# Altium schematic sheet Принципиальная.SchDoc
size 840 x 594 mm; Address1: Address1; Address2: Address2; Address3: Address3; Address4: Address4; SheetNumber: 1; Scale: 1:1; Разраб.: Иванов; Обозначение документа: АБВГ.123456.001 Э3; Пров.: Петров; Утв.: Сидоров; Наименование организации: ОАО "Концерн "МПО-Гидроприбор"; Перв. применение: АБВГ.123456.000; Наименование изделия 1: Плата; Наименование изделия 2: Схема электрическая; Наименование изделия 3: принципиальная; Нач. отд.: Нач. отд.; Фамилия нач. отд.: Сидоров
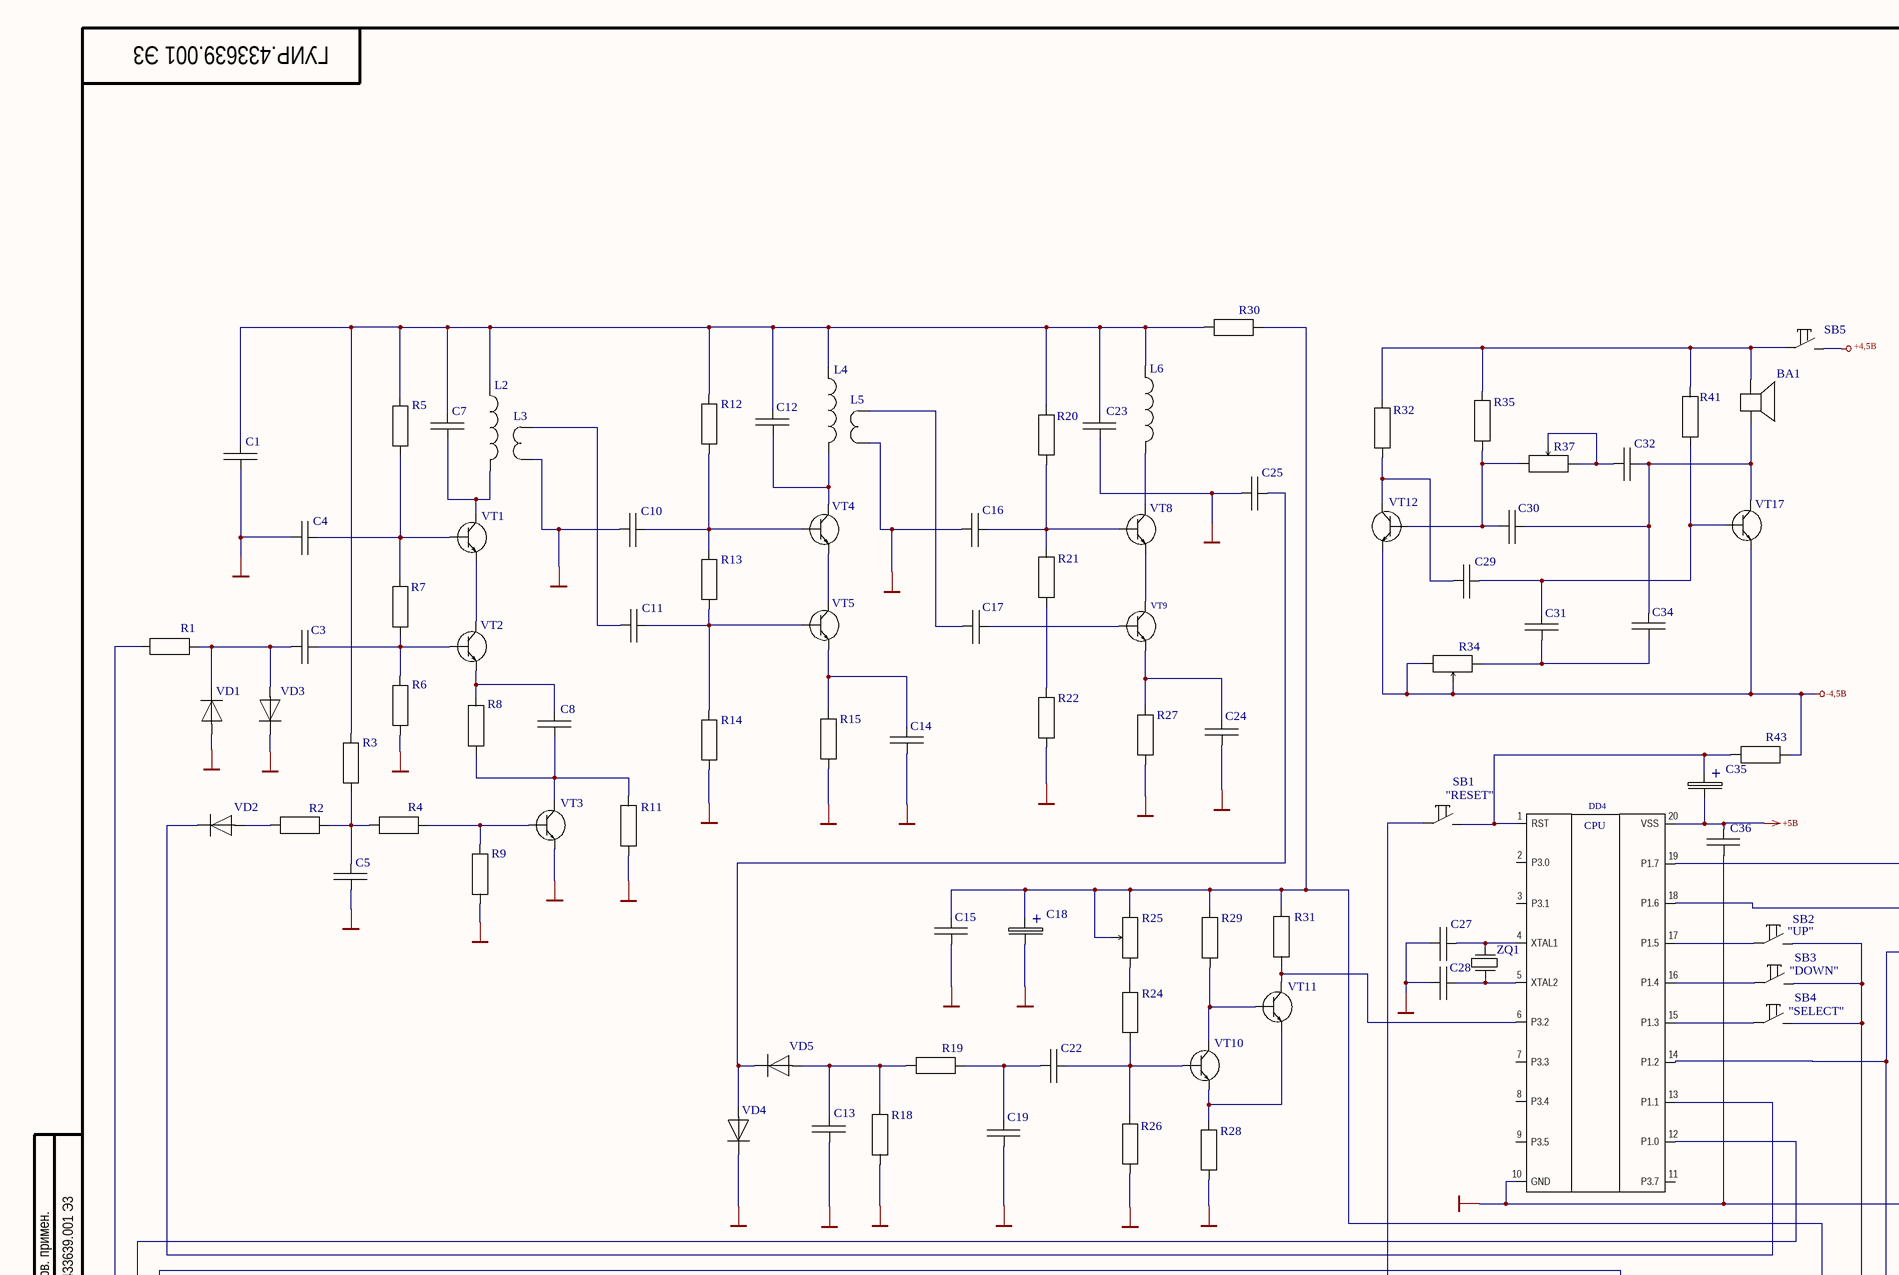
[diagram p0: Принципиальная.SchDoc, top left]
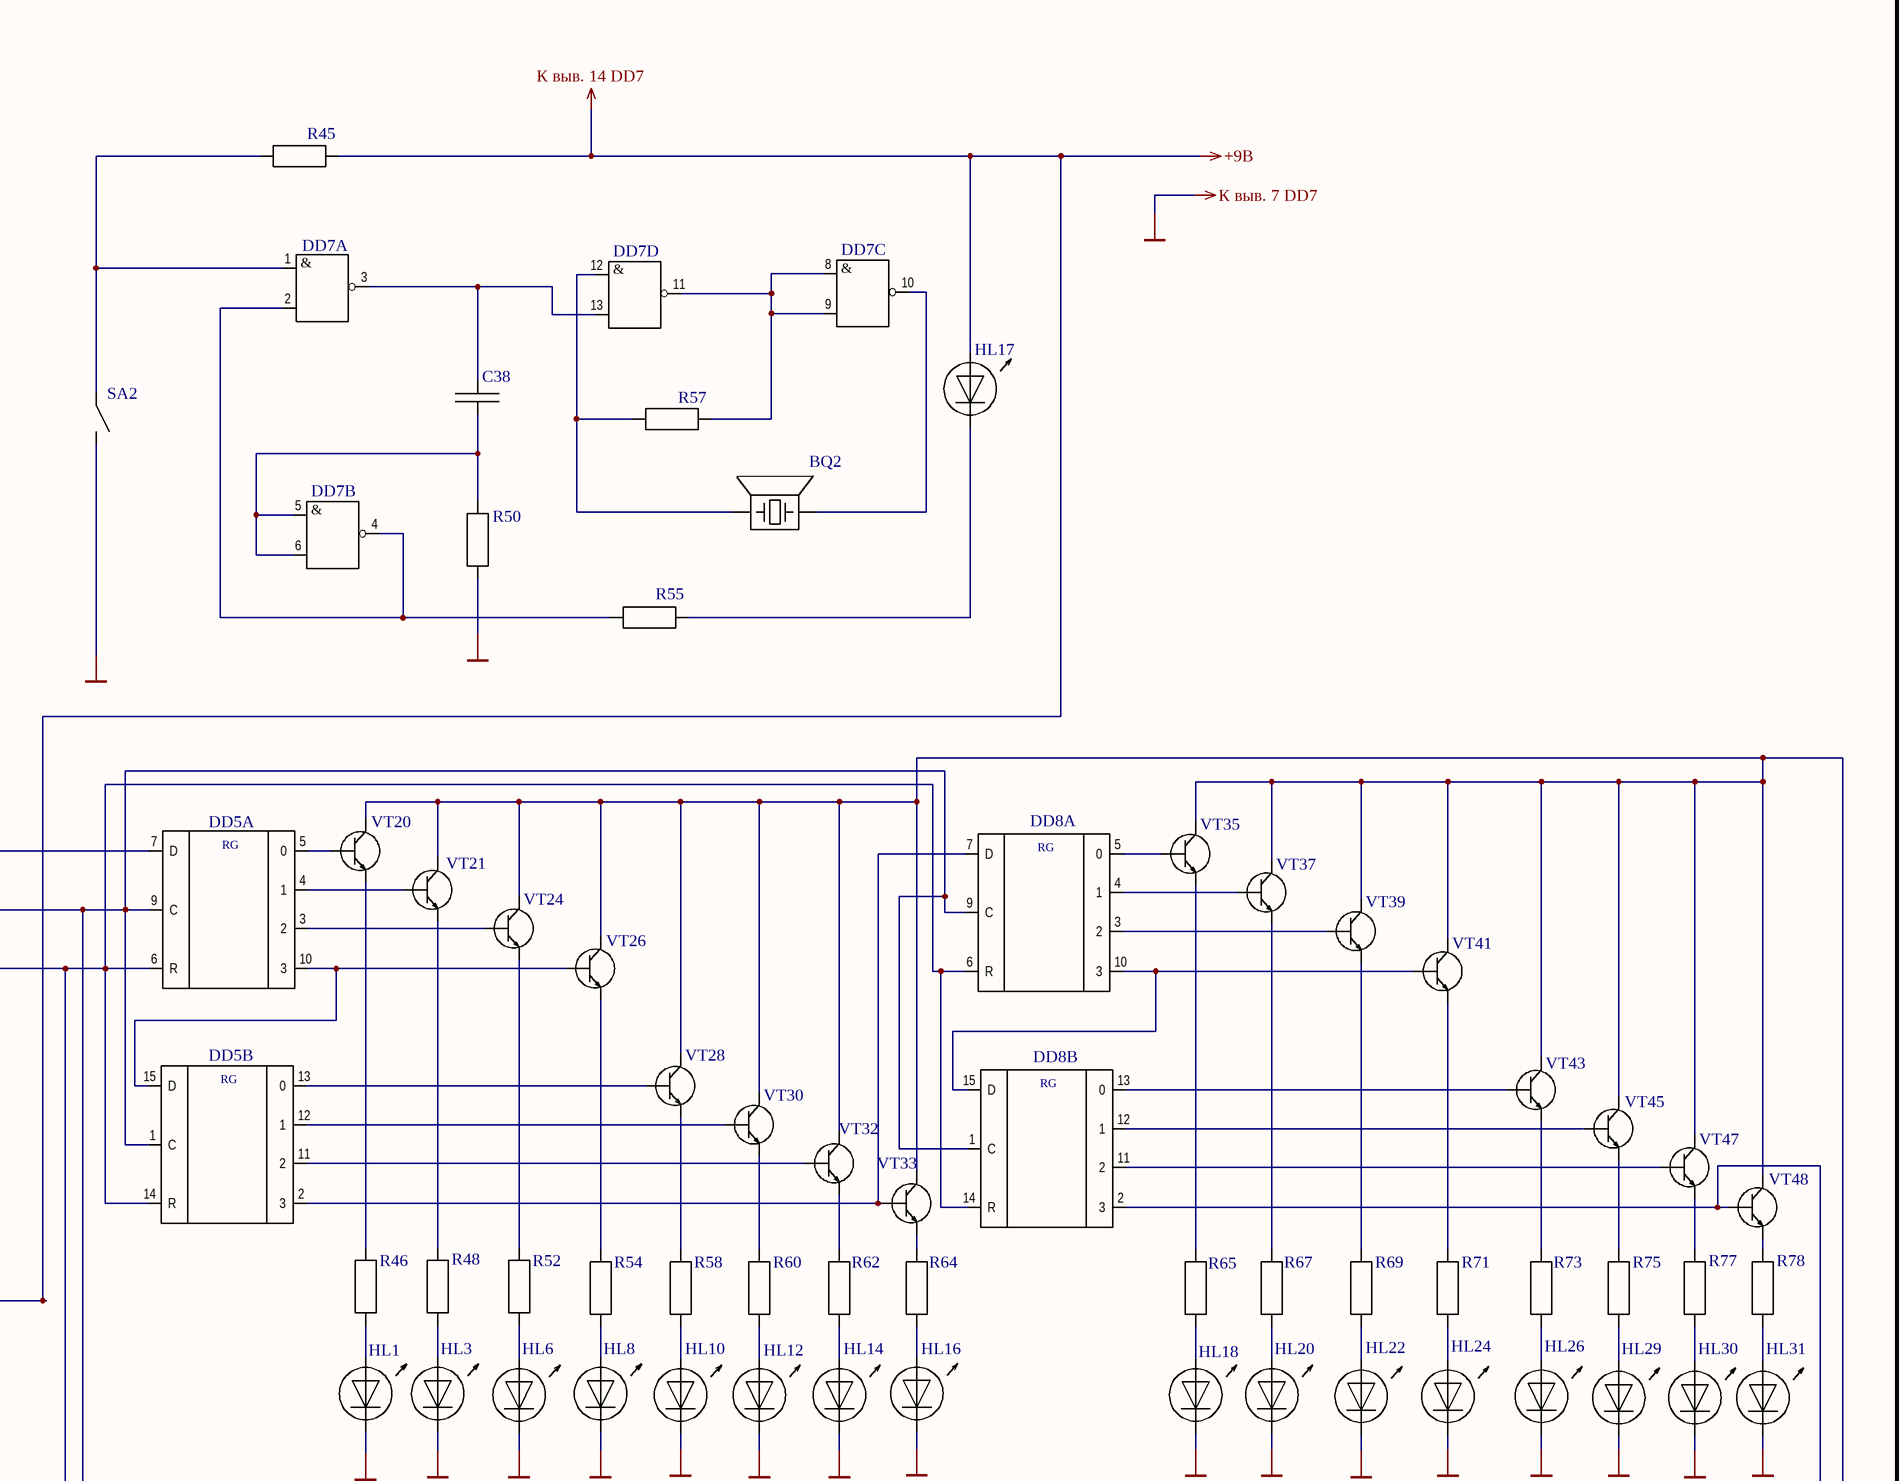
[diagram p1: Принципиальная.SchDoc, top right]
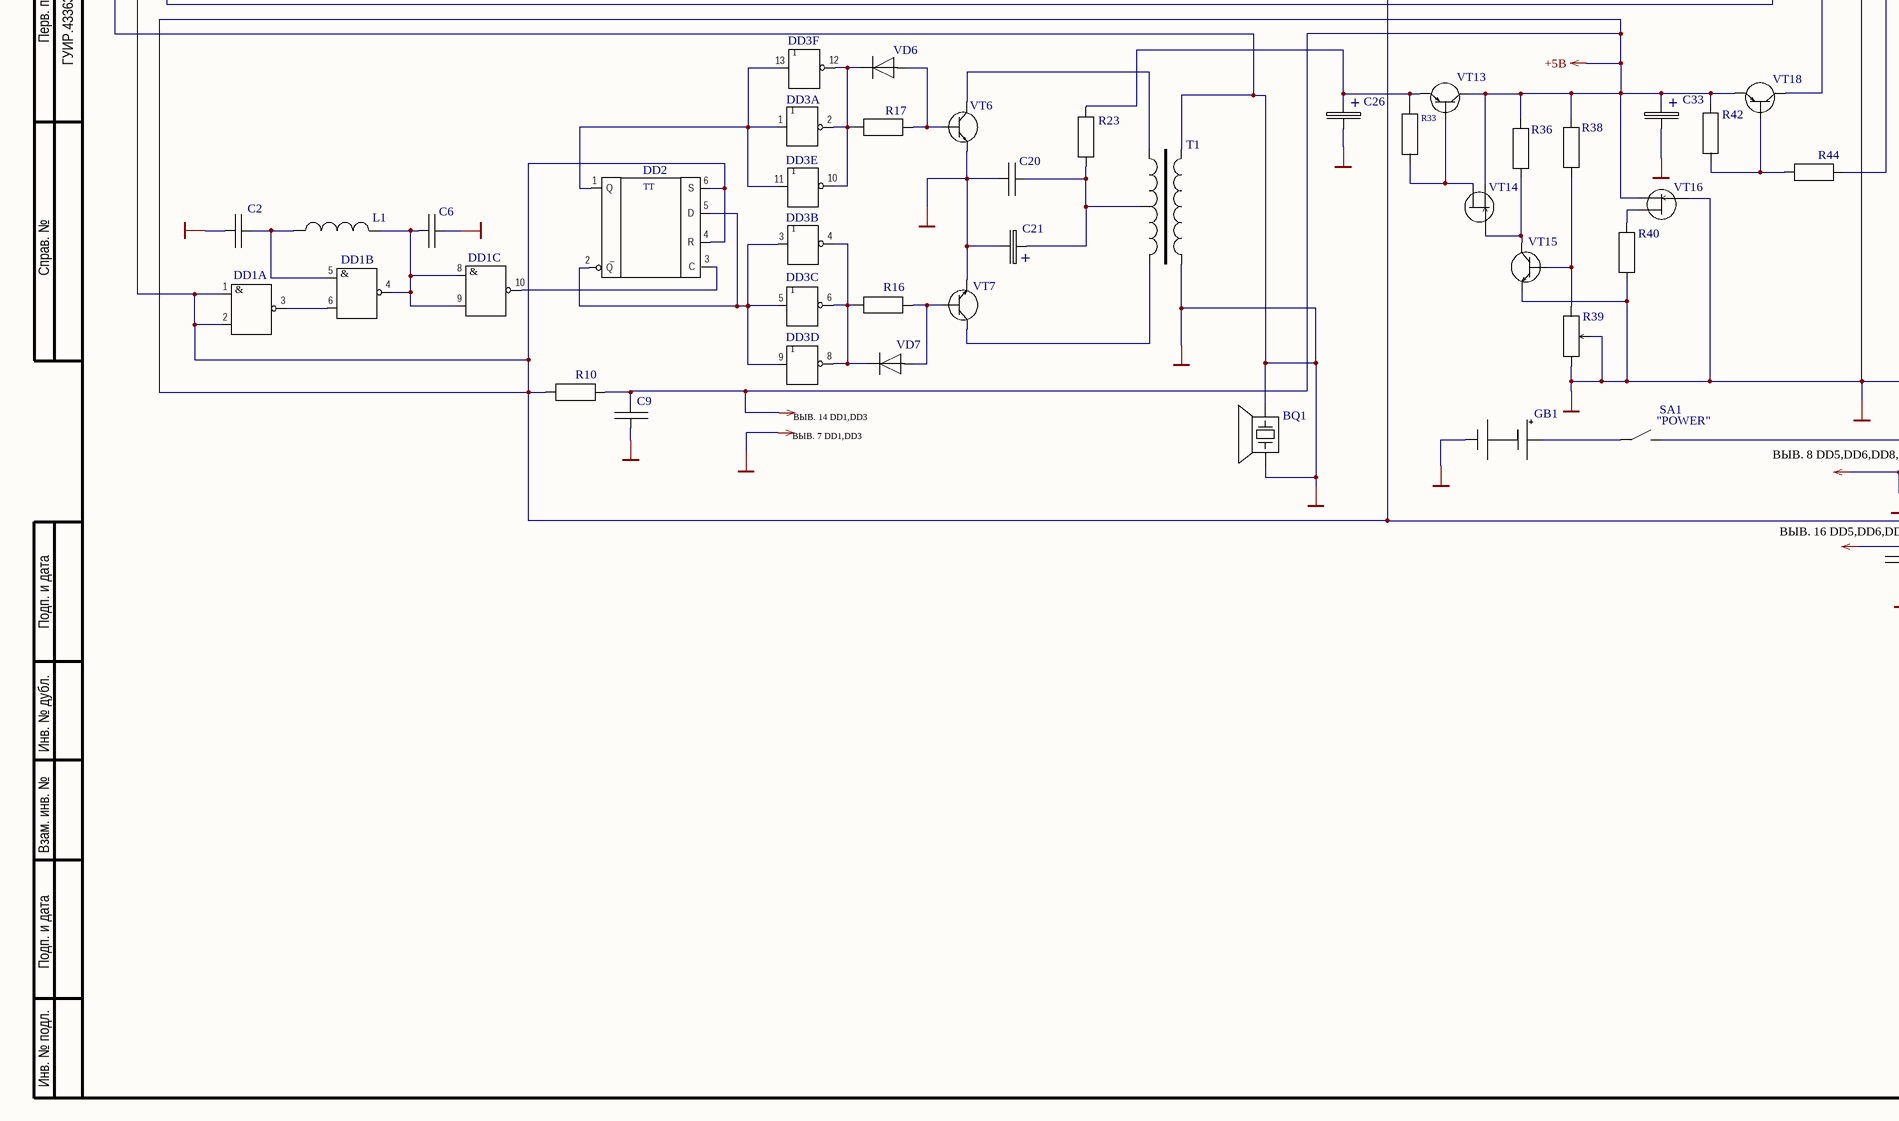
[diagram p2: Принципиальная.SchDoc, bottom left]
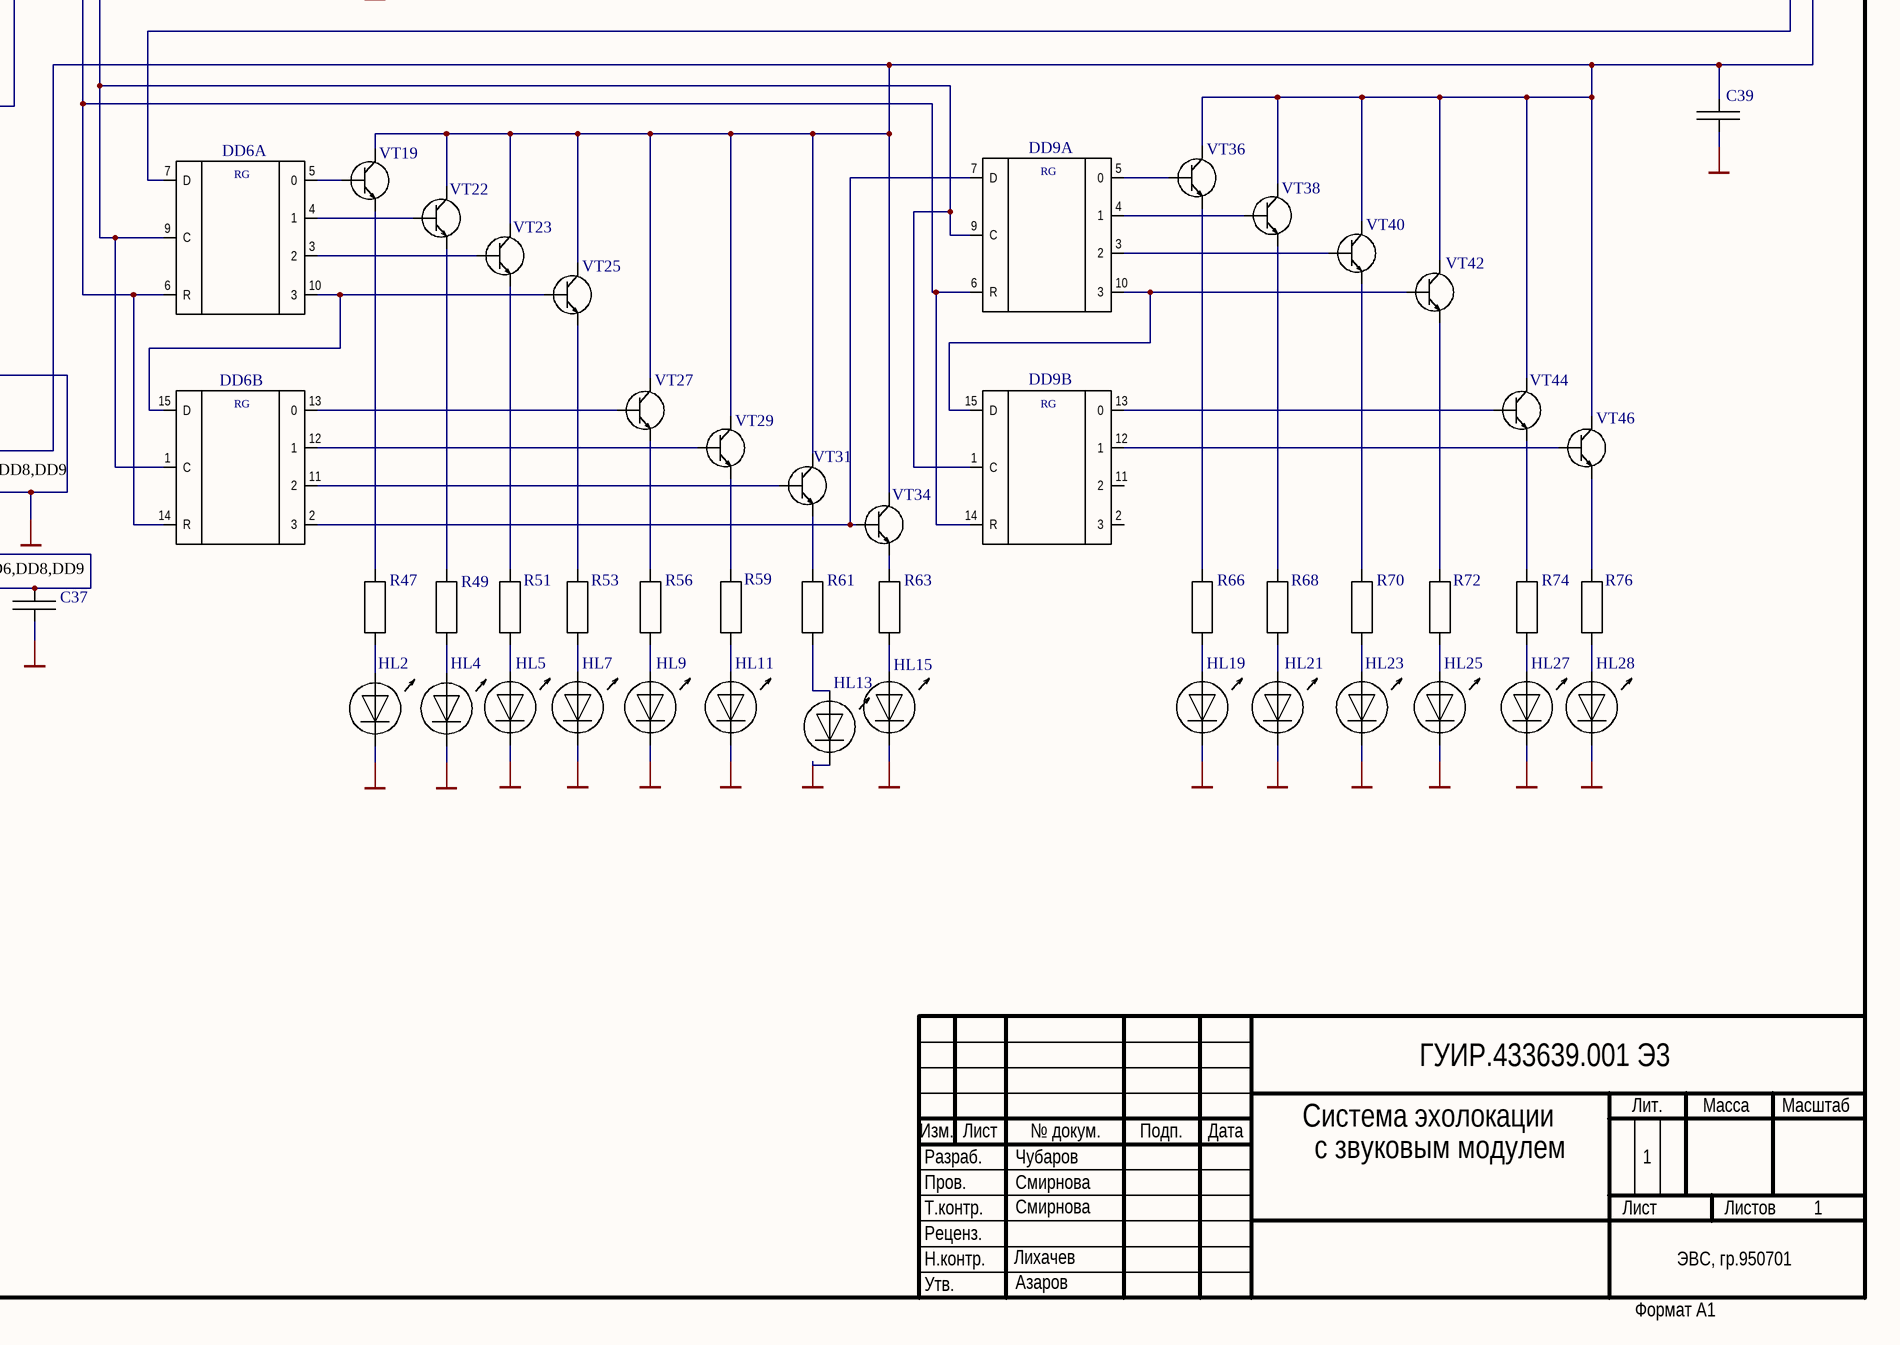
[diagram p3: Принципиальная.SchDoc, bottom right]

## Parts
BA1  DINAMYC  [DINAMIK]  (value not drawn)
BQ1  datchik  [ZP-1]  (value not drawn)
BQ2  datchik  [ZP-1]  (value not drawn)
C1  Cap  [SMD 0603]  (value not drawn)
C2  Cap  [SMD 0603]  (value not drawn)
C3  Cap  [SMD 0603]  (value not drawn)
C4  Cap  [SMD 0603]  (value not drawn)
C5  Cap  [SMD 0603]  (value not drawn)
C6  Cap  [SMD 0603]  (value not drawn)
C7  Cap  [SMD 0603]  (value not drawn)
C8  Cap  [SMD 0603]  (value not drawn)
C9  Cap  [SMD 0603]  (value not drawn)
C10  Cap  [SMD 0603]  (value not drawn)
C11  Cap  [SMD 0603]  (value not drawn)
C12  Cap  [SMD 0603]  (value not drawn)
C13  Cap  [SMD 0603]  (value not drawn)
C14  Cap  [SMD 0603]  (value not drawn)
C15  Cap  [SMD 0603]  (value not drawn)
C16  Cap  [SMD 0603]  (value not drawn)
C17  Cap  [SMD 0603]  (value not drawn)
C18  CapPlus  [cap]  (value not drawn)
C19  Cap  [SMD 0603]  (value not drawn)
C20  Cap  [SMD 0603]  (value not drawn)
C21  CapPlus  [cap]  (value not drawn)
C22  Cap  [SMD 0603]  (value not drawn)
C23  Cap  [SMD 0603]  (value not drawn)
C24  Cap  [SMD 0603]  (value not drawn)
C25  Cap  [SMD 0603]  (value not drawn)
C26  CapPlus  [cap]  (value not drawn)
C27  Cap  [SMD 0603]  (value not drawn)
C28  Cap  [SMD 0603]  (value not drawn)
C29  Cap  [SMD 0603]  (value not drawn)
C30  Cap  [SMD 0603]  (value not drawn)
C31  Cap  [SMD 0603]  (value not drawn)
C32  Cap  [SMD 0603]  (value not drawn)
C33  CapPlus  [cap]  (value not drawn)
C34  Cap  [SMD 0603]  (value not drawn)
C35  CapPlus  [cap]  (value not drawn)
C36  Cap  [SMD 0603]  (value not drawn)
C37  Cap  [SMD 0603]  (value not drawn)
C38  Cap  [SMD 0603]  (value not drawn)
C39  Cap  [SMD 0603]  (value not drawn)
DD1  dd  [DIP14]  (value not drawn)  (parts A,B,C of 4)
DD2  K561TM2  [DD2]  (value not drawn)
DD3  К561ЛН2  [DIP14]  (value not drawn)  (parts A,B,C,D,E,F of 6)
DD4  AT89C2051  [DD4]  (value not drawn)
DD5  К561ИР2  [DIP16]  (value not drawn)  (parts A,B of 2)
DD6  К561ИР2  [DIP16]  (value not drawn)  (parts A,B of 2)
DD7  dd  [DIP14]  (value not drawn)  (parts A,B,C,D of 4)
DD8  К561ИР2  [DIP16]  (value not drawn)  (parts A,B of 2)
DD9  К561ИР2  [DIP16]  (value not drawn)  (parts A,B of 2)
GB1  batareyka  [BATAREIKA]  (value not drawn)
HL1  sveto_diod  [HL]  (value not drawn)
HL2  sveto_diod  [HL]  (value not drawn)
HL3  sveto_diod  [HL]  (value not drawn)
HL4  sveto_diod  [HL]  (value not drawn)
HL5  sveto_diod  [HL]  (value not drawn)
HL6  sveto_diod  [HL]  (value not drawn)
HL7  sveto_diod  [HL]  (value not drawn)
HL8  sveto_diod  [HL]  (value not drawn)
HL9  sveto_diod  [HL]  (value not drawn)
HL10  sveto_diod  [HL]  (value not drawn)
HL11  sveto_diod  [HL]  (value not drawn)
HL12  sveto_diod  [HL]  (value not drawn)
HL13  sveto_diod  [HL]  (value not drawn)
HL14  sveto_diod  [HL]  (value not drawn)
HL15  sveto_diod  [HL]  (value not drawn)
HL16  sveto_diod  [HL]  (value not drawn)
HL17  sveto_diod  [HL]  (value not drawn)
HL18  sveto_diod  [HL]  (value not drawn)
HL19  sveto_diod  [HL]  (value not drawn)
HL20  sveto_diod  [HL]  (value not drawn)
HL21  sveto_diod  [HL]  (value not drawn)
HL22  sveto_diod  [HL]  (value not drawn)
HL23  sveto_diod  [HL]  (value not drawn)
HL24  sveto_diod  [HL]  (value not drawn)
HL25  sveto_diod  [HL]  (value not drawn)
HL26  sveto_diod  [HL]  (value not drawn)
HL27  sveto_diod  [HL]  (value not drawn)
HL28  sveto_diod  [HL]  (value not drawn)
HL29  sveto_diod  [HL]  (value not drawn)
HL30  sveto_diod  [HL]  (value not drawn)
HL31  sveto_diod  [HL]  (value not drawn)
L1  induktor_4  [inductor]  (value not drawn)
L2  induktor_4  [inductor]  (value not drawn)
L3  induktor_2  [INDUCTOR_LOW]  (value not drawn)
L4  induktor_4  [inductor]  (value not drawn)
L5  induktor_2  [INDUCTOR_LOW]  (value not drawn)
L6  induktor_4  [inductor]  (value not drawn)
R1  res  [SMD 0603]  (value not drawn)
R2  res  [SMD 0603]  (value not drawn)
R3  res  [SMD 0603]  (value not drawn)
R4  res  [SMD 0603]  (value not drawn)
R5  res  [SMD 0603]  (value not drawn)
R6  res  [SMD 0603]  (value not drawn)
R7  res  [SMD 0603]  (value not drawn)
R8  res  [SMD 0603]  (value not drawn)
R9  res  [SMD 0603]  (value not drawn)
R10  res  [SMD 0603]  (value not drawn)
R11  res  [SMD 0603]  (value not drawn)
R12  res  [SMD 0603]  (value not drawn)
R13  res  [SMD 0603]  (value not drawn)
R14  res  [SMD 0603]  (value not drawn)
R15  res  [SMD 0603]  (value not drawn)
R16  res  [SMD 0603]  (value not drawn)
R17  res  [SMD 0603]  (value not drawn)
R18  res  [SMD 0603]  (value not drawn)
R19  res  [SMD 0603]  (value not drawn)
R20  res  [SMD 0603]  (value not drawn)
R21  res  [SMD 0603]  (value not drawn)
R22  res  [SMD 0603]  (value not drawn)
R23  res  [SMD 0603]  (value not drawn)
R24  res  [SMD 0603]  (value not drawn)
R25  res_per  [21-0051H]  (value not drawn)
R26  res  [SMD 0603]  (value not drawn)
R27  res  [SMD 0603]  (value not drawn)
R28  res  [SMD 0603]  (value not drawn)
R29  res  [SMD 0603]  (value not drawn)
R30  res  [SMD 0603]  (value not drawn)
R31  res  [SMD 0603]  (value not drawn)
R32  res  [SMD 0603]  (value not drawn)
R33  res  [SMD 0603]  (value not drawn)
R34  res_per  [21-0051H]  (value not drawn)
R35  res  [SMD 0603]  (value not drawn)
R36  res  [SMD 0603]  (value not drawn)
R37  res_per  [21-0051H]  (value not drawn)
R38  res  [SMD 0603]  (value not drawn)
R39  res_per  [21-0051H]  (value not drawn)
R40  res  [SMD 0603]  (value not drawn)
R41  res  [SMD 0603]  (value not drawn)
R42  res  [SMD 0603]  (value not drawn)
R43  res  [SMD 0603]  (value not drawn)
R44  res  [SMD 0603]  (value not drawn)
R45  res  [SMD 0603]  (value not drawn)
R46  res  [SMD 0603]  (value not drawn)
R47  res  [SMD 0603]  (value not drawn)
R48  res  [SMD 0603]  (value not drawn)
R49  res  [SMD 0603]  (value not drawn)
R50  res  [SMD 0603]  (value not drawn)
R51  res  [SMD 0603]  (value not drawn)
R52  res  [SMD 0603]  (value not drawn)
R53  res  [SMD 0603]  (value not drawn)
R54  res  [SMD 0603]  (value not drawn)
R55  res  [SMD 0603]  (value not drawn)
R56  res  [SMD 0603]  (value not drawn)
R57  res  [SMD 0603]  (value not drawn)
R58  res  [SMD 0603]  (value not drawn)
R59  res  [SMD 0603]  (value not drawn)
R60  res  [SMD 0603]  (value not drawn)
R61  res  [SMD 0603]  (value not drawn)
R62  res  [SMD 0603]  (value not drawn)
R63  res  [SMD 0603]  (value not drawn)
R64  res  [SMD 0603]  (value not drawn)
R65  res  [SMD 0603]  (value not drawn)
R66  res  [SMD 0603]  (value not drawn)
R67  res  [SMD 0603]  (value not drawn)
R68  res  [SMD 0603]  (value not drawn)
R69  res  [SMD 0603]  (value not drawn)
R70  res  [SMD 0603]  (value not drawn)
R71  res  [SMD 0603]  (value not drawn)
R72  res  [SMD 0603]  (value not drawn)
R73  res  [SMD 0603]  (value not drawn)
R74  res  [SMD 0603]  (value not drawn)
R75  res  [SMD 0603]  (value not drawn)
R76  res  [SMD 0603]  (value not drawn)
R77  res  [SMD 0603]  (value not drawn)
R78  res  [SMD 0603]  (value not drawn)
SA1  key2  [switch]  (value not drawn)
SA2  key2  [switch]  (value not drawn)
SB1  key3  [BUTTON]  (value not drawn)
SB2  key3  [BUTTON]  (value not drawn)
SB3  key3  [BUTTON]  (value not drawn)
SB4  key3  [BUTTON]  (value not drawn)
SB5  key3  [BUTTON]  (value not drawn)
T1  transformator  [TRANSFORMATOR4]  (value not drawn)
VD1  diod  [res]  (value not drawn)
VD2  diod  [res]  (value not drawn)
VD3  diod  [res]  (value not drawn)
VD4  diod  [res]  (value not drawn)
VD5  diod  [res]  (value not drawn)
VD6  diod  [res]  (value not drawn)
VD7  diod  [res]  (value not drawn)
VT1  TransistorNpN  [Transistor]  (value not drawn)
VT2  TransistorNpN  [Transistor]  (value not drawn)
VT3  TransistorNpN  [Transistor]  (value not drawn)
VT4  TransistorNpN  [Transistor]  (value not drawn)
VT5  TransistorNpN  [Transistor]  (value not drawn)
VT6  TransistorNpN  [Transistor]  (value not drawn)
VT7  TransistorNN  [Transistor]  (value not drawn)
VT8  TransistorNpN  [Transistor]  (value not drawn)
VT9  TransistorNpN  [Transistor]  (value not drawn)
VT10  TransistorNpN  [Transistor]  (value not drawn)
VT11  TransistorNpN  [Transistor]  (value not drawn)
VT12  TransistorNN  [Transistor]  (value not drawn)
VT13  TransistorPnP  [Transistor]  (value not drawn)
VT14  TransistorUNO  [Transistor]  (value not drawn)
VT15  TransistorNN  [Transistor]  (value not drawn)
VT16  TransistorUNO  [Transistor]  (value not drawn)
VT17  TransistorNpN  [Transistor]  (value not drawn)
VT18  TransistorPnP  [Transistor]  (value not drawn)
VT19  TransistorNpN  [Transistor]  (value not drawn)
VT20  TransistorNpN  [Transistor]  (value not drawn)
VT21  TransistorNpN  [Transistor]  (value not drawn)
VT22  TransistorNpN  [Transistor]  (value not drawn)
VT23  TransistorNpN  [Transistor]  (value not drawn)
VT24  TransistorNpN  [Transistor]  (value not drawn)
VT25  TransistorNpN  [Transistor]  (value not drawn)
VT26  TransistorNpN  [Transistor]  (value not drawn)
VT27  TransistorNpN  [Transistor]  (value not drawn)
VT28  TransistorNpN  [Transistor]  (value not drawn)
VT29  TransistorNpN  [Transistor]  (value not drawn)
VT30  TransistorNpN  [Transistor]  (value not drawn)
VT31  TransistorNpN  [Transistor]  (value not drawn)
VT32  TransistorNpN  [Transistor]  (value not drawn)
VT33  TransistorNpN  [Transistor]  (value not drawn)
VT34  TransistorNpN  [Transistor]  (value not drawn)
VT35  TransistorNpN  [Transistor]  (value not drawn)
VT36  TransistorNpN  [Transistor]  (value not drawn)
VT37  TransistorNpN  [Transistor]  (value not drawn)
VT38  TransistorNpN  [Transistor]  (value not drawn)
VT39  TransistorNpN  [Transistor]  (value not drawn)
VT40  TransistorNpN  [Transistor]  (value not drawn)
VT41  TransistorNpN  [Transistor]  (value not drawn)
VT42  TransistorNpN  [Transistor]  (value not drawn)
VT43  TransistorNpN  [Transistor]  (value not drawn)
VT44  TransistorNpN  [Transistor]  (value not drawn)
VT45  TransistorNpN  [Transistor]  (value not drawn)
VT46  TransistorNpN  [Transistor]  (value not drawn)
VT47  TransistorNpN  [Transistor]  (value not drawn)
VT48  TransistorNpN  [Transistor]  (value not drawn)
ZQ1  Resonator  [ZQ]  (value not drawn)

## Nets
+5B: BQ1.1 BQ1.2 C1.2(B) C2.1(A) C4.1(A) C5.2(B) C6.2(B) C9.1(A) C9.2(B) C10.1(A) C13.2(B) C14.2(B) C15.2(B) C16.1(A) C18.2(B) C19.2(B) C20.1(A) C21.2(B) C23.2(B) C24.2(B) C25.1(A) C26.2(B) C27.1(A) C28.1(A) C33.1(A) C33.2(B) C35.2(B) C36.1(A) C36.2(B) C37.1(A) C37.2(B) C39.2(B) DD1.1 DD1.2 DD2.4(R) DD2.6(S) DD4.10(GND) DD4.12(P1.0) DD4.20(VSS) GB1.N HL1.2 HL2.2 HL3.2 HL4.2 HL5.2 HL6.2 HL7.2 HL8.2 HL9.2 HL10.2 HL11.2 HL12.2 HL13.2 HL14.2 HL15.2 HL16.2 HL17.1 HL18.2 HL19.2 HL20.2 HL21.2 HL22.2 HL23.2 HL24.2 HL25.2 HL26.2 HL27.2 HL28.2 HL29.2 HL30.2 HL31.2 L3.2 L5.2 R1.1(A) R6.2(B) R9.1(A) R10.1(A) R10.2(B) R11.2(B) R14.1(A) R15.2(B) R18.1(A) R22.2(B) R26.1(A) R27.2(B) R28.1(A) R36.2(B) R38.2(B) R39.2(B) R39.3(C) R40.1(A) R42.2(B) R45.2(B) R50.2(B) SA2.2(B) SB2.2(B) SB3.2(B) SB4.2(B) SB5.2(B) T1.3 T1.4 VD1.1 VD3.2 VD4.2 VT3.3(C) VT6.3(C) VT7.1(A) VT13.3(C) VT14.3(C) VT15.1(A) VT16.2(B) VT16.3(C) VT18.1(A)  [also labelled +9В, GND, К выв. 14 DD7, К выв. 7 DD7]
-4,5В: R34.2(B) R34.3(C) R43.2(B) VT12.1(A) VT17.3(C)
NetBA1_N: BA1.N C30.2(B) C32.2(B) C34.1(A) VT17.1(A)
NetBA1_P: BA1.P R32.2(B) R35.2(B) R41.1(A) SB5.1(A)
NetBQ2_1: BQ2.1 DD7.10
NetBQ2_2: BQ2.2 DD7.12 R57.1(A)
NetC1_1: C1.1(A) C7.1(A) C12.1(A) C23.1(A) L2.1 L4.1 L6.1 R3.2(B) R5.1(A) R12.2(B) R20.1(A) R30.1(A)
NetC2_2: C2.2(B) DD1.5 L1.1
NetC3_1: C3.1(A) R1.2(B) VD1.2 VD3.1
NetC3_2: C3.2(B) R6.1(A) R7.2(B) VT2.2(B)
NetC4_2: C4.2(B) R5.2(B) R7.1(A) VT1.2(B)
NetC5_1: C5.1(A) R2.2(B) R3.1(A) R4.1(A)
NetC6_1: C6.1(A) DD1.4 DD1.8 DD1.9 L1.2
NetC7_2: C7.2(B) L2.2 VT1.1(A)
NetC8_1: C8.1(A) R8.1(A) VT2.3(C)
NetC8_2: C8.2(B) R8.2(B) R11.1(A) VT3.1(A)
NetC10_2: C10.2(B) R12.1(A) R13.2(B) VT4.2(B)
NetC11_1: C11.1(A) L3.1
NetC11_2: C11.2(B) R13.1(A) R14.2(B) VT5.2(B)
NetC12_2: C12.2(B) L4.2 VT4.1(A)
NetC13_1: C13.1(A) R18.2(B) R19.1(A) VD5.1
NetC14_1: C14.1(A) R15.1(A) VT5.3(C)
NetC15_1: C15.1(A) C18.1(A) R25.2(B) R25.3(C) R29.2(B) R30.2(B) R31.2(B) VT18.3(C)
NetC16_2: C16.2(B) R20.2(B) R21.1(A) VT8.2(B)
NetC17_1: C17.1(A) L5.1
NetC17_2: C17.2(B) VT9.2(B)
NetC19_1: C19.1(A) C22.1(A) R19.2(B)
NetC20_2: C20.2(B) C21.1(A) R23.1(A) T1.5
NetC22_2: C22.2(B) R24.1(A) R26.2(B) VT10.2(B)
NetC24_1: C24.1(A) R27.1(A) VT9.3(C)
NetC25_2: C25.2(B) VD4.1 VD5.2
NetC26_1: C26.1(A) R23.2(B) R33.2(B) VT13.1(A)
NetC27_2: C27.2(B) DD4.4(XTAL1) ZQ1.2
NetC28_2: C28.2(B) DD4.5(XTAL2) ZQ1.1
NetC29_1: C29.1(A) R32.1(A) VT12.3(C)
NetC29_2: C29.2(B) C31.1(A) R41.2(B) VT17.2(B)
NetC30_1: C30.1(A) R35.1(A) R37.1(A) VT12.2(B)
NetC31_2: C31.2(B) C34.2(B) R34.1(A)
NetC32_1: C32.1(A) R37.2(B) R37.3(C)
NetC35_1: C35.1(A) DD4.1(RST) R43.1(A) SB1.2(B)
NetC38_1: C38.1(A) DD7.3 DD7.13
NetC38_2: C38.2(B) DD7.5 DD7.6 R50.1(A)
NetC39_1: C39.1(A) VT19.1(A) VT20.1(A) VT21.1(A) VT22.1(A) VT23.1(A) VT24.1(A) VT25.1(A) VT26.1(A) VT27.1(A) VT28.1(A) VT29.1(A) VT30.1(A) VT31.1(A) VT32.1(A) VT33.1(A) VT34.1(A) VT35.1(A) VT36.1(A) VT37.1(A) VT38.1(A) VT39.1(A) VT40.1(A) VT41.1(A) VT42.1(A) VT43.1(A) VT44.1(A) VT45.1(A) VT46.1(A) VT47.1(A) VT48.1(A)
NetDD1_3: DD1.3 DD1.6
NetDD1_10: DD1.10 DD2.3(C)
NetDD2_1: DD2.1(Q) DD3.1 DD3.11 DD3.13
NetDD2_2: DD2.2(Q) DD2.5(D) DD3.3 DD3.5 DD3.9
NetDD3_2: DD3.2 DD3.10 DD3.12 R17.1(A) VD6.2
NetDD3_4: DD3.4 DD3.6 DD3.8 R16.1(A) VD7.2
NetDD4_6: DD4.6(P3.2) R31.1(A) VT11.1(A)
NetDD4_13: DD4.13(P1.1) VD2.2
NetDD4_14: DD4.14(P1.2) DD5.6(R) DD5.14(R) DD6.6(R) DD6.14(R) DD8.6(R) DD8.14(R) DD9.6(R) DD9.14(R) R44.1(A)
NetDD4_15: DD4.15(P1.3) SB4.1(A)
NetDD4_16: DD4.16(P1.4) SB3.1(A)
NetDD4_17: DD4.17(P1.5) SB2.1(A)
NetDD4_18: DD4.18(P1.6) DD5.1(C) DD5.9(C) DD6.1(C) DD6.9(C) DD8.1(C) DD8.9(C) DD9.1(C) DD9.9(C)
NetDD4_19: DD4.19(P1.7) DD5.7(D)
NetDD5_2: DD5.2(3) DD8.7(D) VT33.2(B)
NetDD5_3: DD5.3(2) VT24.2(B)
NetDD5_4: DD5.4(1) VT21.2(B)
NetDD5_5: DD5.5(0) VT20.2(B)
NetDD5_10: DD5.10(3) DD5.15(D) VT26.2(B)
NetDD5_11: DD5.11(2) VT32.2(B)
NetDD5_12: DD5.12(1) VT30.2(B)
NetDD5_13: DD5.13(0) VT28.2(B)
NetDD6_2: DD6.2(3) DD9.7(D) VT34.2(B)
NetDD6_3: DD6.3(2) VT23.2(B)
NetDD6_4: DD6.4(1) VT22.2(B)
NetDD6_5: DD6.5(0) VT19.2(B)
NetDD6_7: DD6.7(D) DD8.2(3) VT48.2(B)
NetDD6_10: DD6.10(3) DD6.15(D) VT25.2(B)
NetDD6_11: DD6.11(2) VT31.2(B)
NetDD6_12: DD6.12(1) VT29.2(B)
NetDD6_13: DD6.13(0) VT27.2(B)
NetDD7_1: DD7.1 R45.1(A) SA2.1(A)
NetDD7_2: DD7.2 DD7.4 R55.1(A)
NetDD7_8: DD7.8 DD7.9 DD7.11 R57.2(B)
NetDD8_3: DD8.3(2) VT39.2(B)
NetDD8_4: DD8.4(1) VT37.2(B)
NetDD8_5: DD8.5(0) VT35.2(B)
NetDD8_10: DD8.10(3) DD8.15(D) VT41.2(B)
NetDD8_11: DD8.11(2) VT47.2(B)
NetDD8_12: DD8.12(1) VT45.2(B)
NetDD8_13: DD8.13(0) VT43.2(B)
NetDD9_3: DD9.3(2) VT40.2(B)
NetDD9_4: DD9.4(1) VT38.2(B)
NetDD9_5: DD9.5(0) VT36.2(B)
NetDD9_10: DD9.10(3) DD9.15(D) VT42.2(B)
NetDD9_12: DD9.12(1) VT46.2(B)
NetDD9_13: DD9.13(0) VT44.2(B)
NetGB1_P: GB1.P SA1.1(A)
NetHL1_1: HL1.1 R46.1(A)
NetHL2_1: HL2.1 R47.1(A)
NetHL3_1: HL3.1 R48.1(A)
NetHL4_1: HL4.1 R49.1(A)
NetHL5_1: HL5.1 R51.1(A)
NetHL6_1: HL6.1 R52.1(A)
NetHL7_1: HL7.1 R53.1(A)
NetHL8_1: HL8.1 R54.1(A)
NetHL9_1: HL9.1 R56.1(A)
NetHL10_1: HL10.1 R58.1(A)
NetHL11_1: HL11.1 R59.1(A)
NetHL12_1: HL12.1 R60.1(A)
NetHL13_1: HL13.1 R61.1(A)
NetHL14_1: HL14.1 R62.1(A)
NetHL15_1: HL15.1 R63.1(A)
NetHL16_1: HL16.1 R64.1(A)
NetHL17_2: HL17.2 R55.2(B)
NetHL18_1: HL18.1 R65.1(A)
NetHL19_1: HL19.1 R66.1(A)
NetHL20_1: HL20.1 R67.1(A)
NetHL21_1: HL21.1 R68.1(A)
NetHL22_1: HL22.1 R69.1(A)
NetHL23_1: HL23.1 R70.1(A)
NetHL24_1: HL24.1 R71.1(A)
NetHL25_1: HL25.1 R72.1(A)
NetHL26_1: HL26.1 R73.1(A)
NetHL27_1: HL27.1 R74.1(A)
NetHL28_1: HL28.1 R76.1(A)
NetHL29_1: HL29.1 R75.1(A)
NetHL30_1: HL30.1 R77.1(A)
NetHL31_1: HL31.1 R78.1(A)
NetL6_2: L6.2 VT8.1(A)
NetR2_1: R2.1(A) VD2.1
NetR4_2: R4.2(B) R9.2(B) VT3.2(B)
NetR16_2: R16.2(B) VD7.1 VT7.2(B)
NetR17_2: R17.2(B) VD6.1 VT6.2(B)
NetR21_2: R21.2(B) R22.1(A)
NetR24_2: R24.2(B) R25.1(A)
NetR28_2: R28.2(B) VT10.3(C) VT11.3(C)
NetR29_1: R29.1(A) VT10.1(A) VT11.2(B)
NetR33_1: R33.1(A) VT13.2(B) VT14.1(A)
NetR36_1: R36.1(A) VT14.2(B) VT15.3(C)
NetR38_1: R38.1(A) R39.1(A) VT15.2(B)
NetR40_2: R40.2(B) VT16.1(A)
NetR42_1: R42.1(A) R44.2(B) VT18.2(B)
NetR46_2: R46.2(B) VT20.3(C)
NetR47_2: R47.2(B) VT19.3(C)
NetR48_2: R48.2(B) VT21.3(C)
NetR49_2: R49.2(B) VT22.3(C)
NetR51_2: R51.2(B) VT23.3(C)
NetR52_2: R52.2(B) VT24.3(C)
NetR53_2: R53.2(B) VT25.3(C)
NetR54_2: R54.2(B) VT26.3(C)
NetR56_2: R56.2(B) VT27.3(C)
NetR58_2: R58.2(B) VT28.3(C)
NetR59_2: R59.2(B) VT29.3(C)
NetR60_2: R60.2(B) VT30.3(C)
NetR61_2: R61.2(B) VT31.3(C)
NetR62_2: R62.2(B) VT32.3(C)
NetR63_2: R63.2(B) VT34.3(C)
NetR64_2: R64.2(B) VT33.3(C)
NetR65_2: R65.2(B) VT35.3(C)
NetR66_2: R66.2(B) VT36.3(C)
NetR67_2: R67.2(B) VT37.3(C)
NetR68_2: R68.2(B) VT38.3(C)
NetR69_2: R69.2(B) VT39.3(C)
NetR70_2: R70.2(B) VT40.3(C)
NetR71_2: R71.2(B) VT41.3(C)
NetR72_2: R72.2(B) VT42.3(C)
NetR73_2: R73.2(B) VT43.3(C)
NetR74_2: R74.2(B) VT44.3(C)
NetR75_2: R75.2(B) VT45.3(C)
NetR76_2: R76.2(B) VT46.3(C)
NetR77_2: R77.2(B) VT47.3(C)
NetR78_2: R78.2(B) VT48.3(C)
NetT1_1: T1.1 VT6.1(A)
NetT1_2: T1.2 VT7.3(C)
NetVT1_3: VT1.3(C) VT2.1(A)
NetVT4_3: VT4.3(C) VT5.1(A)
NetVT8_3: VT8.3(C) VT9.1(A)

Not connected (* = marked no-connect by the designer): DD4 2(P3.0) 3(P3.1) 7(P3.3) 8(P3.4) 9(P3.5) 11(P3.7); DD9 2(3) 11(2); SA1 2(B); SB1 1(A)

## Notes on the sheet
- ГУИР.433639.001 Э3
- (near SB5) +4,5В
- (near SB1) "RESET"
- (near SB2) "UP"
- (near SB3) "DOWN"
- (near SB4) "SELECT"
- Перв. примен.
- Справ. №
- ВЫВ. 14 DD1,DD3
- (near SA1) "POWER"
- ВЫВ. 7 DD1,DD3
- ВЫВ. 8 DD5,DD6,DD8,DD9
- (near C37) ВЫВ. 16 DD5,DD6,DD8,DD9
- Подп. и дата
- Инв. № дубл.
- Взам. инв. №
- Разраб.
- Изм.
- Лист
- Чубаров
- № докум.
- Подп.
- Дата
- Система эхолокации
- с звуковым модулем
- 1
- Лит.
- Масса
- Масштаб
- Пров.
- Т.контр.
- Смирнова
- Листов
- Инв. № подл.
- Утв.
- Н.контр.
- Реценз.
- Лихачев
- Азаров
- ЭВС, гр.950701
- Формат А1
- (in symbol AT89C2051) CPU
- (in symbol CapPlus) +
- (in symbol dd, part A) &
- (in symbol dd, part B) &
- (in symbol dd, part C) &
- (in symbol dd, part D) &
- (in symbol K561TM2) TT; –
- (in symbol К561ИР2, part A) RG
- (in symbol К561ИР2, part B) RG